# EAGLE design bmp085 (EAGLE 5.10)
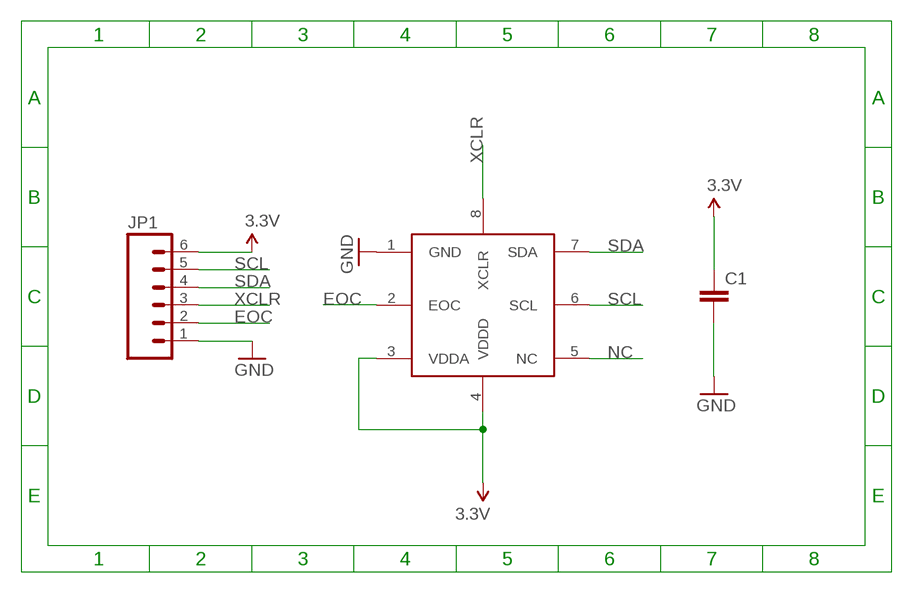
[diagram p0: schematic, sheet 1]

## Parts
C1  C-EUC0805  [C0805]
JP1  M06SIP  [1X06]
U$1  BMP085  [BMP085]

## Nets
3.3V: C1.1 JP1.6 U$1.3(VDDA) U$1.4(VDDD)
EOC: JP1.2 U$1.2(EOC)
GND: C1.2 JP1.1 U$1.1(GND)
NC: U$1.5(NC)
SCL: JP1.5 U$1.6(SCL)
SDA: JP1.4 U$1.7(SDA)
XCLR: JP1.3 U$1.8(XCLR)

## Library data of the parts
C1 = rcl:C-EU: CAPACITOR, European symbol
JP1 = SparkFun:M06: Header 6 Standard 6-pin 0.1" header. Use with straight break away headers (SKU : PRT-00116), right angle break away headers (PRT-00553), swiss pins (PRT-00743), machine pins (PRT-00117), and female headers (PRT-00115). Molex polarized connector foot print use with SKU : PRT-08094 with associated crimp pins and housings. NOTES ON THE VARIANTS LOCK and LOCK_LONGPADS... This footprint was designed to help hold the alignment of a through-hole component (i.e. 6-pin header) while soldering it into place. You may notice that each hole has been shifted either up or down by 0.005 of an inch from it's more standard position (which is a perfectly straight line). This slight alteration caused the pins (the squares in the middle) to touch the edges of the holes. Because they are alternating, it causes a "brace" to hold the component in place. 0.005 has proven to be the perfect amount of "off-center" position when using our standard breakaway headers. Although looks a little odd when you look at the bare footprint, once you have a header in there, the alteration is very hard to notice. Also, if you push a header all the way into place, it is covered up entirely on the bottom side. This idea of altering the position of holes to aid alignment will be further integrated into the Sparkfun Library for other footprints. It can help hold any component with 3 or more connection pins.
U$1 = SparkFun:BMP085

## Board
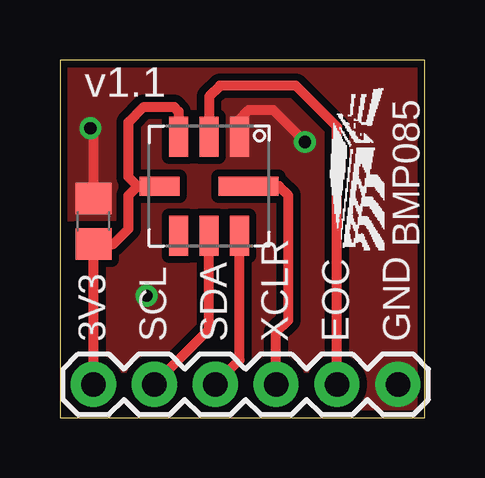
[diagram p1: board, top side]
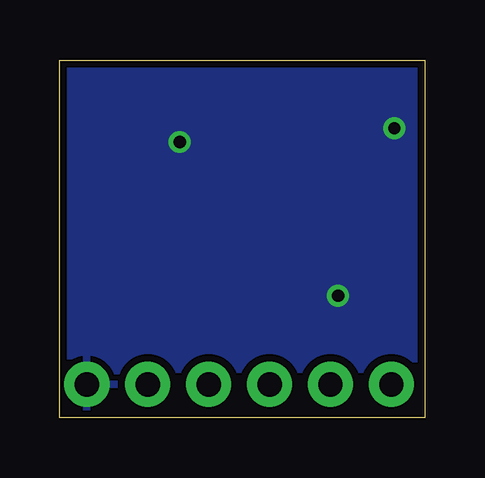
[diagram p2: board, bottom side, seen from below]

Size 15.22 x 14.91 mm. Coordinates in mm from the lower left corner, seen from the top.
Outline: 0,0 15.22,0 15.22,14.91 0,14.91 0,0
Copper layers (1*16): Top 0.035mm / dielectric 1.5mm / Bottom 0.035mm
Design rules "default *": minimum track width 10mil, minimum drill 24mil, track to track 8mil, track to pad 8mil, pad to pad 8mil, via to via 8mil, smd to smd 8mil, copper to edge 5mil, drill to drill 8mil, minimum pad ring 10mil, minimum via ring 8mil, stop-mask expansion 4mil, vias tented up to drill 0mil, thermal gap 10mil

### Footprints (pad centres in the part's own frame; a part is rotated, then mirrored left to right if it is on the bottom)
C0805 = smd 1.3 x 1.5: 1 -0.95,0; 2 0.95,0
1X06 = drill 1.016 pad 1.88 round: 1 0,0; 2 2.54,0; 3 5.08,0; 4 7.62,0; 5 10.16,0; 6 12.7,0
BMP085 = smd 1.67 x 0.8: 1 -2.065,1.27; 2 -2.065,0; 3 -2.065,-1.27; 5 2.065,-1.27; 6 2.065,0; 7 2.065,1.27 | smd 0.8 x 1.67: 4 0,-2.065 | smd 0.8 x 2.5: 8 0,1.65

### Placement (x,y rotation side)
C1  1.4,8.19 90 top
JP1  14.1,1.4 180 top
U$1  6.22,9.65 270 top

### Tracks (layer width: path | path; a pad name or v marks a point on that pad's centre or on a via)
3.3V
  Top 0.406: JP1.6 C1.1 2.23,7.24 2.86,7.87 2.86,9.27 3.24,9.65 | 3.24,9.65 U$1.4 | U$1.3 4.95,12.76 4.76,12.95 3.49,12.95 2.86,12.32 2.86,10.03 3.24,9.65
EOC
  Top 0.406: U$1.2 6.22,13.4 6.67,13.84 9.84,13.84 11.56,12.13 JP1.2
GND  (via drill 0.51)
  Top 0.406: U$1.1 7.49,12.45 7.87,12.83 8.89,12.83 v10.22,11.49 | C1.2 1.4,11.94 v1.27,12.06
  other vias: 3.62,5.09
  pour Bottom (isolate 0.305): 0,15.24 15.88,15.24 15.88,0 -0.64,0 -0.64,13.34 -0.64,15.24
  pour Top (isolate 0.305, no thermals): 0,15.24 15.88,15.24 15.88,0 -0.64,0 -0.64,13.34 -0.64,15.24
SCL
  Top 0.406: U$1.6 6.22,3.68 JP1.5
SDA
  Top 0.406: U$1.7 7.49,2.41 JP1.4
XCLR
  Top 0.406: U$1.8 9.14,9.65 9.53,9.27 9.53,4.06 9.02,3.56 JP1.3

### Text on the board
tNames: v1.1 | BMP085 | 3V3 | SCL | SDA | XCLR | EOC | GND